# EAGLE design Smartwatch-EXTRA-TOP (EAGLE 9.6.2)
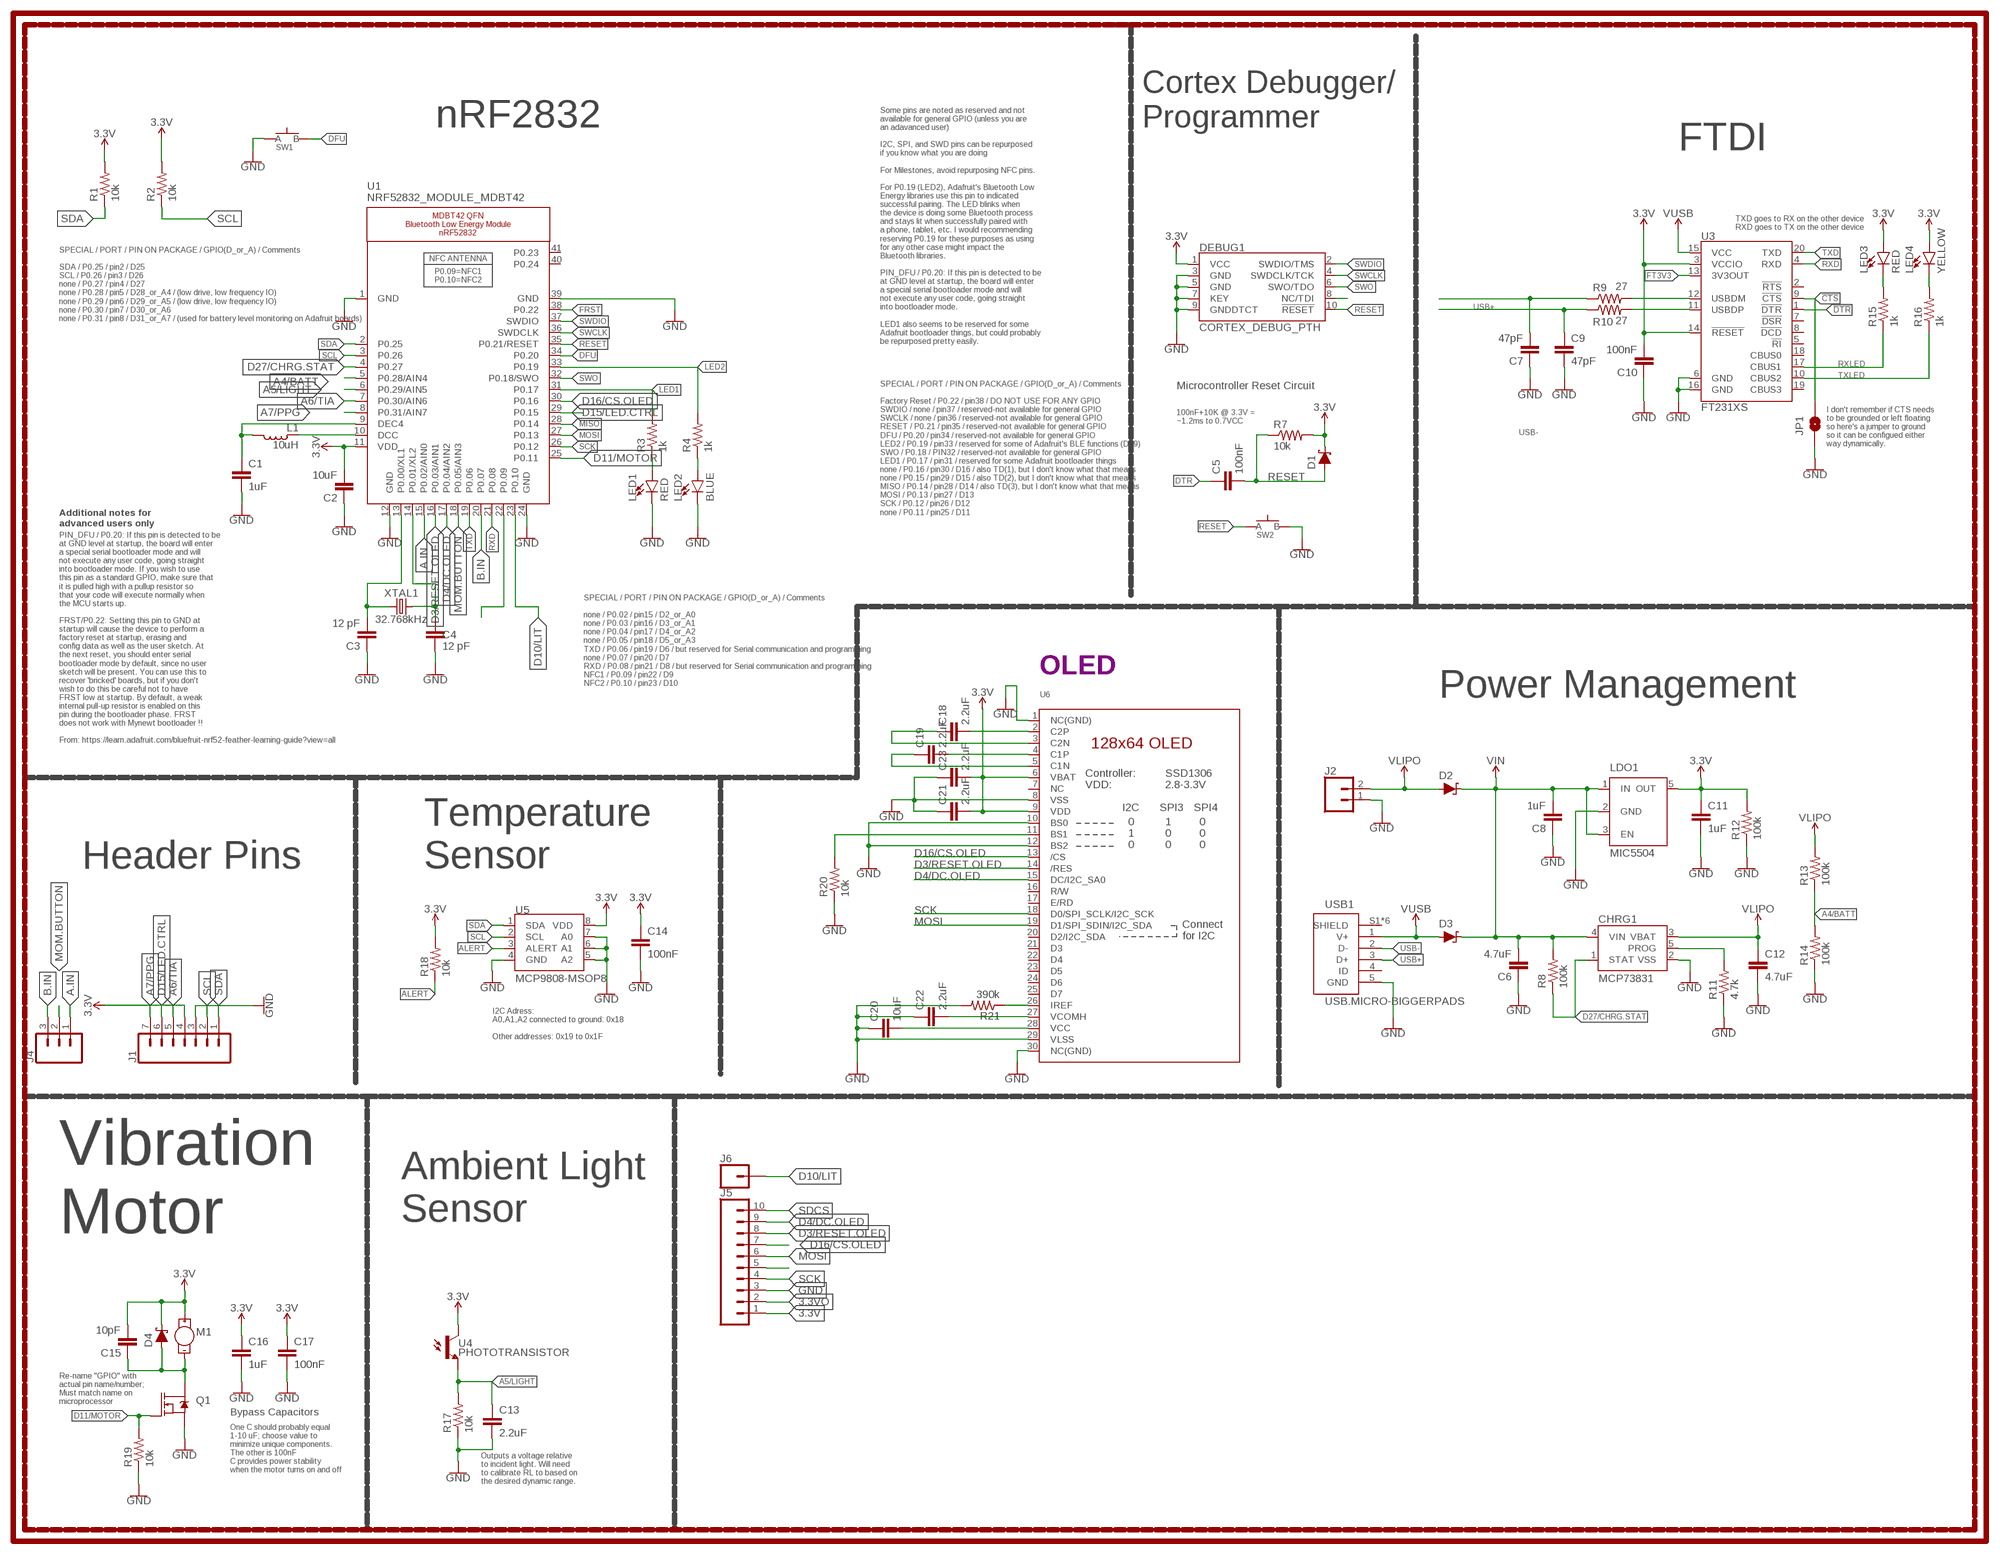
[diagram p0: schematic, sheet 1]

## Parts
C1  1uF  CAPACITOR0603  [C0603]
C2  10uF  CAPACITOR0805  [C0805]
C3  12 pF  CAPACITOR0603  [C0603]
C4  12 pF  CAPACITOR0603  [C0603]
C5  100nF  CAPACITOR0603  [C0603]
C6  4.7uF  CAPACITOR0603  [C0603]
C7  47pF  CAPACITOR0603  [C0603]
C8  1uF  CAPACITOR0603  [C0603]
C9  47pF  CAPACITOR0603  [C0603]
C10  100nF  CAPACITOR0603  [C0603]
C11  1uF  CAPACITOR0603  [C0603]
C12  4.7uF  CAPACITOR0603  [C0603]
C13  2.2uF  CAPACITOR0603  [C0603]
C14  100nF  CAPACITOR0603  [C0603]
C15  10pF  CAPACITOR0603  [C0603]
C16  1uF  CAPACITOR0603  [C0603]
C17  100nF  CAPACITOR0603  [C0603]
C18  2.2uF  CAPACITOR0402  [C0402]
C19  2.2uF  CAPACITOR0402  [C0402]
C20  10uF  CAPACITOR0603  [C0603]
C21  2.2uF  CAPACITOR0402  [C0402]
C22  2.2uF  CAPACITOR0402  [C0402]
C23  2.2uF  CAPACITOR0402  [C0402]
CHRG1  MCP73831  [SOT23-5]
D1  SCHOTTKY-USC  [USC]
D2  SCHOTTKY-USC  [USC]
D3  SCHOTTKY-USC  [USC]
D4  SCHOTTKY-USC  [USC]
DEBUG1  CORTEX_DEBUG_PTH  [2X5-PTH-1.27MM]
J1  CONN_07-1.27MM  [1X07_1.27MM]
J2  CONN_02  [1X02]
J4  CONN_03.50MIL  [1X03_1.27MM]
J5  CONN_10  [1X10_NO_SILK]
J6  CONN_01  [1X01]
JP1  JUMPER-SMT_2_NO_SILK  [SMT-JUMPER_2_NO_SILK]
L1  10uH  INDUCTOR0603  [L0603]
LDO1  MIC5504  [SOT23-5]
LED1  RED  LED0603  [LED-0603]
LED2  BLUE  LED0603  [LED-0603]
LED3  RED  LED0603  [LED-0603]
LED4  YELLOW  LED0603  [LED-0603]
M1  VIB.MOTOR.C0720B015F  [WIRE.LEADS]
Q1  NFET-AO3404A  [SOT23-3]
R1  10k  RESISTOR0603  [R0603]
R2  10k  RESISTOR0603  [R0603]
R3  1k  RESISTOR0603  [R0603]
R4  1k  RESISTOR0603  [R0603]
R7  10k  RESISTOR0603  [R0603]
R8  100k  RESISTOR0603  [R0603]
R9  27  RESISTOR0603  [R0603]
R10  27  RESISTOR0603  [R0603]
R11  4.7k  RESISTOR0603  [R0603]
R12  100k  RESISTOR0603  [R0603]
R13  100k  RESISTOR0603  [R0603]
R14  100k  RESISTOR0603  [R0603]
R15  1k  RESISTOR0603  [R0603]
R16  1k  RESISTOR0603  [R0603]
R17  10k  RESISTOR0603  [R0603]
R18  10k  RESISTOR0603  [R0603]
R19  10k  RESISTOR0603  [R0603]
R20  10k  RESISTOR0603  [R0603]
R21  390k  RESISTOR0603  [R0603]
SW1  SPST-PTS830GG140-COPY.1-3  [BUTTON-GULLWING]
SW2  SPST-PTS830GG140-COPY.1-3  [BUTTON-GULLWING]
U1  NRF52832_MODULE_MDBT42  [BLE_MODULE_RAYTAC_MDBT42]
U3  FT231XS  [SSOP20_L]
U4  PHOTOTRANSISTOR  [R0603]
U5  MCP9808-MSOP8  [MSOP08]
U6  DISP_OLED_UG-2864HSWEG01-NO-WRAPAROUND  [UG-2864HSWEG01_0.96IN_NO-WRAPAROUND]
USB1  USB.MICRO-BIGGERPADS  [USB-MICRO-01.BIGGERPADS]
XTAL1  32.768kHz  CRYSTALECS-.327-12.5-12-C-TR  [2-SMD.NOLEAD.2.0MMTO1.2MM]

## Nets
3: J5.5
3.3V: C2.2 C10.2 C11.1 C14.1 C15.2 C16.1 C17.1 C21.2 C23.2 D1.-(C) D4.-(C) DEBUG1.1(VCC) J1.4 J5.1 LDO1.5(OUT) LED3.A LED4.A M1.+ R1.2 R2.2 R7.2 R12.2 R18.2 U1.11(VDD) U3.3(VCCIO) U3.14(!RESET) U4.1(C) U5.8(VDD) U6.6(VBAT) U6.9(VDD)
3.3VO: J5.2
!CTS: JP1.2 U3.9(!CTS)
!DTR: U3.1(!DTR)
A4/BATT: R13.1 R14.2 U1.5(P0.28/AIN4)
A5/LIGHT: C13.1 R17.2 U1.6(P0.29/AIN5) U4.2(E)
A6/TIA: J1.5 U1.7(P0.30/AIN6)
A7/PPG: J1.7 U1.8(P0.31/AIN7)
A.IN: J4.1 U1.15(P0.02/AIN0)
ALERT: R18.1 U5.3(ALERT)
B.IN: J4.3 U1.20(P0.07)
D3/RESET.OLED: J5.8 U1.16(P0.03/AIN1) U6.14(/RES)
D4/DC.OLED: J5.9 U1.17(P0.04/AIN2) U6.15(DC/I2C_SA0)
D10/LIT: J6.1 U1.23(P0.10)
D11/MOTOR: Q1.1(G) R19.2 U1.25(P0.11)
D15/LED.CTRL: J1.6 U1.29(P0.15)
D16/CS.OLED: J5.7 U1.30(P0.16) U6.13(/CS)
D27/CHRG.STAT: CHRG1.1(STAT) R8.1 U1.4(P0.27)
DFU: SW1.3(B) U1.34(P0.20)
DTR: C5.1
FRST: U1.38(P0.22)
FT3V3: U3.13(3V3OUT)
GND: C1.2 C2.1 C3.1 C4.2 C6.1 C7.1 C8.1 C9.2 C10.1 C11.2 C12.2 C13.2 C14.2 C16.2 C17.2 C20.1 C21.1 C22.1 C23.1 CHRG1.2(VSS) DEBUG1.3(GND) DEBUG1.5(GND) DEBUG1.7(KEY) DEBUG1.9(GNDDTCT) J1.3 J2.1 J5.3 JP1.1 LDO1.2(GND) LED1.C LED2.C Q1.2(S) R11.1 R12.1 R14.1 R17.1 R19.1 R20.1 R21.2 SW1.1(A) SW2.3(B) U1.1(GND) U1.12(GND) U1.24(GND) U1.39(GND) U3.6(GND) U3.16(GND) U5.4(GND) U5.5(A2) U5.6(A1) U5.7(A0) U6.1(NC(GND)) U6.8(VSS) U6.10(BS0) U6.12(BS2) U6.29(VLSS) U6.30(NC(GND)) USB1.5(GND)
LED1: R3.2 U1.31(P0.17)
LED2: R4.2 U1.33(P0.19)
MISO: U1.28(P0.14)
MOM.BUTTON: J4.2 U1.18(P0.05/AIN3)
MOSI: J5.6 U1.27(P0.13) U6.19(D1/SPI_SDIN/I2C_SDA)
N$4: C3.2 U1.13(P0.00/XL1) XTAL1.P$1
N$5: R20.2 U6.11(BS1)
N$6: C4.1 U1.14(P0.01/XL2) XTAL1.P$2
N$7: R21.1 U6.26(IREF)
N$8: C18.2 U6.2(C2P)
N$9: LED1.A R3.1
N$10: LED2.A R4.1
N$11: L1.1 U1.10(DCC)
N$12: C1.1 L1.2 U1.9(DEC4)
N$13: C18.1 U6.3(C2N)
N$14: DEBUG1.8(NC/TDI)
N$15: C19.2 U6.4(C1P)
N$16: CHRG1.5(PROG) R11.2
N$17: C19.1 U6.5(C1N)
N$18: C15.1 D4.+(A) M1.- Q1.3(D)
N$19: C20.2 U6.28(VCC)
N$20: C22.2 U6.27(VCOMH)
N$25: R9.2 U3.12(USBDM)
N$26: R10.2 U3.11(USBDP)
N$27: LED3.C R15.2
N$28: LED4.C R16.2
P0.09/NFC1: U1.22(P0.09)
RESET: C5.2 D1.+(A) DEBUG1.10(!RESET) R7.1 SW2.1(A) U1.35(P0.21/RESET)
RXD: U1.21(P0.08) U3.4(RXD)
RXLED: R15.1 U3.17(CBUS1)
SCK: J5.4 U1.26(P0.12) U6.18(D0/SPI_SCLK/I2C_SCK)
SCL: J1.2 R2.1 U1.3(P0.26) U5.2(SCL)
SDA: J1.1 R1.1 U1.2(P0.25) U5.1(SDA)
SDCS: J5.10
SWCLK: DEBUG1.4(SWDCLK/TCK) U1.36(SWDCLK)
SWDIO: DEBUG1.2(SWDIO/TMS) U1.37(SWDIO)
SWO: DEBUG1.6(SWO/TDO) U1.32(P0.18/SWO)
TXD: U1.19(P0.06) U3.20(TXD)
TXLED: R16.1 U3.10(CBUS2)
USB+: C9.1 R10.1 USB1.3(D+)
USB-: C7.2 R9.1 USB1.2(D-)
V_USB: D3.+(A) U3.15(VCC) USB1.1(V+) ; supply symbol labelled VUSB
VIN: C6.2 C8.2 CHRG1.4(VIN) D2.-(C) D3.-(C) LDO1.1(IN) LDO1.3(EN) R8.2
VLIPO: C12.1 CHRG1.3(VBAT) D2.+(A) J2.2 R13.2
Unconnected: U1.40(P0.24) U1.41(P0.23) U3.2(!RTS) U3.5(!RI) U3.7(!DSR) U3.8(!DCD) U3.18(CBUS0) U3.19(CBUS3) U6.7(NC) U6.16(R/W) U6.17(E/RD) U6.20(D2/I2C_SDA) U6.21(D3) U6.22(D4) U6.23(D5) U6.24(D6) U6.25(D7) USB1.4(ID) USB1.S1(SHIELD) USB1.S2(SHIELD) USB1.S3(SHIELD) USB1.S4(SHIELD) USB1.S5(SHIELD) USB1.S6(SHIELD)

## Notes on the sheet
- nRF2832
- Cortex Debugger/
  Programmer
- FTDI
- TXD goes to RX on the other device
  RXD goes to TX on the other device
- SPECIAL / PORT / PIN ON PACKAGE / GPIO(D_or_A) / Comments
  
  SDA / P0.25 / pin2 / D25
  SCL / P0.26 / pin3 / D26
  none / P0.27 / pin4 / D27
  none / P0.28 / pin5 / D28_or_A4 / (low drive, low frequency IO)
  none / P0.29 / pin6 / D29_or_A5 / (low drive, low frequency IO)
  none / P0.30 / pin7 / D30_or_A6
  none / P0.31 / pin8 / D31_or_A7 / (used for battery level monitoring on Adafruit boards)
- Some pins are noted as reserved and not
  available for general GPIO (unless you are
  an adavanced user)
  
  I2C, SPI, and SWD pins can be repurposed
  if you know what you are doing
  
  For Milestones, avoid repurposing NFC pins.
  
  For P0.19 (LED2), Adafruit's Bluetooth Low
  Energy libraries use this pin to indicated
  successful pairing. The LED blinks when
  the device is doing some Bluetooth process
  and stays lit when successfully paired with
  a phone, tablet, etc. I would recommending
  reserving P0.19 for these purposes as using
  for any other case might impact the
  Bluetooth libraries.
  
  PIN_DFU / P0.20: If this pin is detected to be
  at GND level at startup, the board will enter
  a special serial bootloader mode and will
  not execute any user code, going straight
  into bootloader mode.
  
  LED1 also seems to be reserved for some
  Adafruit bootloader things, but could probably
  be repurposed pretty easily.
- Microcontroller Reset Circuit
- 100nF+10K @ 3.3V =
  ~1.2ms to 0.7VCC
- I don't remember if CTS needs
  to be grounded or left floating
  so here's a jumper to ground
  so it can be configued either
  way dynamically.
- SPECIAL / PORT / PIN ON PACKAGE / GPIO(D_or_A) / Comments
  
  Factory Reset / P0.22 / pin38 / DO NOT USE FOR ANY GPIO
  SWDIO / none / pin37 / reserved-not available for general GPIO
  SWCLK / none / pin36 / reserved-not available for general GPIO
  RESET / P0.21 / pin35 / reserved-not available for general GPIO
  DFU / P0.20 / pin34 / reserved-not available for general GPIO
  LED2 / P0.19 / pin33 / reserved for some of Adafruit's BLE functions (D19)
  SWO / P0.18 / PIN32 / reserved-not available for general GPIO
  LED1 / P0.17 / pin31 / reserved for some Adafruit bootloader things
  none / P0.16 / pin30 / D16 / also TD(1), but I don't know what that means
  none / P0.15 / pin29 / D15 / also TD(2), but I don't know what that means
  MISO / P0.14 / pin28 / D14 / also TD(3), but I don't know what that means
  MOSI / P0.13 / pin27 / D13
  SCK / P0.12 / pin26 / D12
  none / P0.11 / pin25 / D11
- Additional notes for
  advanced users only
- OLED
- SPECIAL / PORT / PIN ON PACKAGE / GPIO(D_or_A) / Comments
  
  none / P0.02 / pin15 / D2_or_A0
  none / P0.03 / pin16 / D3_or_A1
  none / P0.04 / pin17 / D4_or_A2
  none / P0.05 / pin18 / D5_or_A3
  TXD / P0.06 / pin19 / D6 / but reserved for Serial communication and programming
  none / P0.07 / pin20 / D7
  RXD / P0.08 / pin21 / D8 / but reserved for Serial communication and programming
  NFC1 / P0.09 / pin22 / D9
  NFC2 / P0.10 / pin23 / D10
- Power Management
- PIN_DFU / P0.20: If this pin is detected to be
  at GND level at startup, the board will enter
  a special serial bootloader mode and will
  not execute any user code, going straight
  into bootloader mode. If you wish to use
  this pin as a standard GPIO, make sure that
  it is pulled high with a pullup resistor so
  that your code will execute normally when
  the MCU starts up.
  
  FRST/P0.22: Setting this pin to GND at
  startup will cause the device to perform a
  factory reset at startup, erasing and
  config data as well as the user sketch. At
  the next reset, you should enter serial
  bootloader mode by default, since no user
  sketch will be present. You can use this to
  recover 'bricked' boards, but if you don't
  wish to do this be careful not to have
  FRST low at startup. By default, a weak
  internal pull-up resistor is enabled on this
  pin during the bootloader phase. FRST
  does not work with Mynewt bootloader !!
  
  From: https://learn.adafruit.com/bluefruit-nrf52-feather-learning-guide?view=all
- Header Pins
- Temperature
  Sensor
- I2C Adress:
  A0,A1,A2 connected to ground: 0x18
  
  Other addresses: 0x19 to 0x1F
- Ambient Light
  Sensor
- Vibration
  Motor
- Re-name "GPIO" with
  actual pin name/number;
  Must match name on
  microprocessor
- Bypass Capacitors
- One C should probably equal
  1-10 uF; choose value to
  minimize unique components.
  The other is 100nF
  C provides power stability
  when the motor turns on and off
- Outputs a voltage relative
  to incident light. Will need
  to calibrate RL to based on
  the desired dynamic range.

## Library data of the parts
C1-C23 = LinnesLab-Passives:CAPACITOR
CHRG1 = LinnesLab-Power:MCP73831: MCP73831T Li-Ion, Li-Pol Controller Miniature single cell, fully integrated Li-Ion, Li-polymer charge management controller Datasheet <http://ww1.microchip.com/downloads/en/DeviceDoc/20001984g.pdf> SparkFun Products: SparkFun ESP32 Thing <https://www.sparkfun.com/products/13907> SparkFun 9DoF Razor IMU M0 <https://www.sparkfun.com/products/14001>; PROD_ID: IC-09995
D1-D4 = LinnesLab-DiscreteSemi:SCHOTTKY: Schottky diode A Schottky diode is a semiconductor diode which has a low forward voltage drop and a very fast switching action. Example: Digi-Key Part Number: RB161MM-20CT-ND
DEBUG1 = LinnesLab-Connectors:CORTEX_DEBUG: Cortex Debug Connector - 10 pin Supports JTAG debug, Serial Wire debug, and Serial Wire Viewer. PTH and SMD connector options available. General Connector Information <http://infocenter.arm.com/help/topic/com.arm.doc.faqs/attached/13634/cortex_debug_connectors.pdf> Products: PTH Connector <http://www.digikey.com/product-detail/en/cnc-tech/3220-10-0100-00/1175-1627-ND/3883661> -via Digi-Key SparkFun PSoc <https://www.sparkfun.com/products/13229> SparkFun T <https://www.sparkfun.com/products/13810>
J1 = LinnesLab-Connectors:CONN_07: Multi connection point. Often used as Generic Header-pin footprint for 0.1 inch spaced/style header connections On any of the 0.1 inch spaced packages, you can populate with these: Break Away Headers - Straight <https://www.sparkfun.com/products/116> (PRT-00116) Break Away Male Headers - Right Angle <https://www.sparkfun.com/products/553> (PRT-00553) Female Headers <https://www.sparkfun.com/products/115> (PRT-00115) Break Away Headers - Machine Pin <https://www.sparkfun.com/products/117> (PRT-00117) Break Away Female Headers - Swiss Machine Pin <https://www.sparkfun.com/products/743> (PRT-00743) For SCREWTERMINALS and SPRING TERMINALS visit here: Screw Terimnals on SparkFun.com <https://www.sparkfun.com/search/results?term=Screw+Terminals> (5mm/3.5mm/2.54mm spacing) This device is also useful as a general connection point to wire up your design to another part of your project. Our various solder wires solder well into these plated through hole pads. Hook-Up Wire - Assortment (Stranded, 22 AWG) <https://www.sparkfun.com/products/11375> (PRT-11375) Hook-Up Wire - Assortment (Solid Core, 22 AWG) <https://www.sparkfun.com/products/11367> (PRT-11367) View the entire wire category on our website here <https://www.sparkfun.com/categories/141> Special notes: Molex polarized connector foot print use with SKU : PRT-08231 with associated crimp pins and housings. 1MM SMD Version SKU: PRT-10208 NOTES ON THE VARIANTS LOCK and LOCK_LONGPADS... This footprint was designed to help hold the alignment of a through-hole component (i.e. 6-pin header) while soldering it into place. You may notice that each hole has been shifted either up or down by 0.005 of an inch from it's more standard position (which is a perfectly straight line). This slight alteration caused the pins (the squares in the middle) to touch the edges of the holes. Because they are alternating, it causes a "brace" to hold the component in place. 0.005 has proven to be the perfect amount of "off-center" position when using our standard breakaway headers. Although looks a little odd when you look at the bare footprint, once you have a header in there, the alteration is very hard to notice. Also,if you push a header all the way into place, it is covered up entirely on the bottom side.
J2 = LinnesLab-Connectors:CONN_02: Multi connection point. Often used as Generic Header-pin footprint for 0.1 inch spaced/style header connections On any of the 0.1 inch spaced packages, you can populate with these: Break Away Headers - Straight <https://www.sparkfun.com/products/116> (PRT-00116) Break Away Male Headers - Right Angle <https://www.sparkfun.com/products/553> (PRT-00553) Female Headers <https://www.sparkfun.com/products/115> (PRT-00115) Break Away Headers - Machine Pin <https://www.sparkfun.com/products/117> (PRT-00117) Break Away Female Headers - Swiss Machine Pin <https://www.sparkfun.com/products/743> (PRT-00743) For SCREWTERMINALS and SPRING TERMINALS visit here: Screw Terimnals on SparkFun.com <https://www.sparkfun.com/search/results?term=Screw+Terminals> (5mm/3.5mm/2.54mm spacing) This device is also useful as a general connection point to wire up your design to another part of your project. Our various solder wires solder well into these plated through hole pads. Hook-Up Wire - Assortment (Stranded, 22 AWG) <https://www.sparkfun.com/products/11375> (PRT-11375) Hook-Up Wire - Assortment (Solid Core, 22 AWG) <https://www.sparkfun.com/products/11367> (PRT-11367) View the entire wire category on our website here <https://www.sparkfun.com/categories/141> Special notes: Molex polarized connector foot print use with: PRT-08233 with associated crimp pins and housings. 2.54_SCREWTERM for use with PRT-10571. 3.5mm Screw Terminal footprints for PRT-08084 5mm Screw Terminal footprints for use with PRT-08432
J4 = LinnesLab-Connectors:CONN_03: Multi connection point. Often used as Generic Header-pin footprint for 0.1 inch spaced/style header connections On any of the 0.1 inch spaced packages, you can populate with these: Break Away Headers - Straight <https://www.sparkfun.com/products/116> (PRT-00116) Break Away Male Headers - Right Angle <https://www.sparkfun.com/products/553> (PRT-00553) Female Headers <https://www.sparkfun.com/products/115> (PRT-00115) Break Away Headers - Machine Pin <https://www.sparkfun.com/products/117> (PRT-00117) Break Away Female Headers - Swiss Machine Pin <https://www.sparkfun.com/products/743> (PRT-00743) Stackable Header - 3 Pin (Female, 0.1") <https://www.sparkfun.com/products/13875> (PRT-13875) For SCREWTERMINALS and SPRING TERMINALS visit here: Screw Terimnals on SparkFun.com <https://www.sparkfun.com/search/results?term=Screw+Terminals> (5mm/3.5mm/2.54mm spacing) This device is also useful as a general connection point to wire up your design to another part of your project. Our various solder wires solder well into these plated through hole pads. Hook-Up Wire - Assortment (Stranded, 22 AWG) <https://www.sparkfun.com/products/11375> (PRT-11375) Hook-Up Wire - Assortment (Solid Core, 22 AWG) <https://www.sparkfun.com/products/11367> (PRT-11367) View the entire wire category on our website here <https://www.sparkfun.com/categories/141> Special notes: Molex polarized connector foot print use with SKU : PRT-08232 with associated crimp pins and housings.
J5 = LinnesLab-Connectors:CONN_10
J6 = LinnesLab-Connectors:CONN_01: Single connection point. Often used as Generic Header-pin footprint for 0.1 inch spaced/style header connections On any of the 0.1 inch spaced packages, you can populate with these: Break Away Headers - Straight <https://www.sparkfun.com/products/116> (PRT-00116) Break Away Male Headers - Right Angle <https://www.sparkfun.com/products/553> (PRT-00553) Female Headers <https://www.sparkfun.com/products/115> (PRT-00115) Break Away Headers - Machine Pin <https://www.sparkfun.com/products/117> (PRT-00117) Break Away Female Headers - Swiss Machine Pin <https://www.sparkfun.com/products/743> (PRT-00743) This device is also useful as a general connection point to wire up your design to another part of your project. Our various solder wires solder well into these plated through hole pads. Hook-Up Wire - Assortment (Stranded, 22 AWG) <https://www.sparkfun.com/products/11375> (PRT-11375) Hook-Up Wire - Assortment (Solid Core, 22 AWG) <https://www.sparkfun.com/products/11367> (PRT-11367) View the entire wire category on our website here <https://www.sparkfun.com/categories/141> Special notes: SMTSO-256-ET is a "flush mount" nut for a 4-40 screw. We mostly use this on specialty testbeds; it is a nice way to connect hardware to your PCB at an adjustable hieght. Also note, the SNAP packages are for using a snappable style connector. We sell a baggie of snaps and they are also used on two LilyPad designs: Snap Assortment - 30 pack (male and female) <https://www.sparkfun.com/products/11347> (DEV-11347) LilyPad Arduino SimpleSnap <https://www.sparkfun.com/products/10941> (DEV-10941) LilyPad SimpleSnap Protoboard <https://www.sparkfun.com/products/10940> (DEV-10940)
JP1 = LinnesLab-Switches:JUMPER-SMT_2_NO: Normally open jumper This jumper has two pads in close proximity to each other. Apply solder to close the connection. Round pads are easier to solder for beginners, but are a lot larger. SparkFun Product that uses the round pads: SparkFun EL Sequencer <https://www.sparkfun.com/products/12781>
L1 = LinnesLab-Passives:INDUCTOR
LDO1 = LinnesLab-Power:MIC5504: MIC5504 Voltage Regulator Output Voltages: 1.0V to 3.3V Input Voltages: 2.5V to 5.5V Link to Datasheet http://ww1.microchip.com/downloads/en/DeviceDoc/MIC550X.pdf
LED1-LED4 = LinnesLab-LED:LED: LED (Generic) Standard schematic elements and footprints for 5mm, 3mm, 1206, and 0603 sized LEDs. Generic LEDs with no color specified. LTST-C190KGKT: arrow indicates cathode
M1 = LinnesLab-Electromechanical:VIB.MOTOR.C0720B015F
Q1 = LinnesLab-DiscreteSemi:NFET: N-channel MOSFETs Voltage controlled devices that allow control of high current outputs. SparkFun Products: SparkFun OpenScale <https://www.sparkfun.com/products/13261> SparkFun Digital Sandbox <https://www.sparkfun.com/products/12651> SparkFun Monster Moto Shield <https://www.sparkfun.com/products/10182> SparkFun MOSFET Power Controller <https://www.sparkfun.com/products/11214>
R1-R4 R7-R21 = LinnesLab-Passives:RESISTOR
SW1 SW2 = LinnesLab-Switches:SPST-PTS830GG140-COPY
U1 = LinnesLab-Microcontrollers:NRF52832_MODULE_MDBT42: MDBT42 - BLE Module (nRF52832 QFN) VDD: 1.7-3.6V; SPICEPREFIX: X
U3 = LinnesLab-DigitalIC:FT231X: FTDI FT231X Full Speed USB to Full-handshake UART This USB2.0 Full Speed IC offers a compact bridge to full handshake UART interfaces. The device is a UART, capable of operating up to 3MBaud, with low power consumption (8mA). The FT231X includes the complete FT-X series feature set and enables USB to be added into a system design quickly and easily over a UART interface. Datasheet <http://cdn.sparkfun.com/datasheets/Components/General%20IC/DS_FT231X.pdf>; DIGIKEY: 768-1156-5-ND; MFN: FT231XS-U
U4 = LinnesLab-Sensors:PHOTOTRANSISTOR
U5 = LinnesLab-Sensors:MCP9808; SPICEPREFIX: X
U6 = LinnesLab-Displays:DISP_OLED_UG-2864HSWEG01: UG-2864HSWEG01 OLED display Both 1.3" and 0.96" models share the same FPC tab footprint, only the screen dimensions vary.
USB1 = LinnesLab-Connectors:USB.MICRO: DigiKey PN: 609-4613-1-ND
XTAL1 = LinnesLab-Clocks:CRYSTAL; DIGIKEY: XC2288CT-ND; FREQ: 32.7680KHZ; LOAD_CAP: 12.5pF

## Board
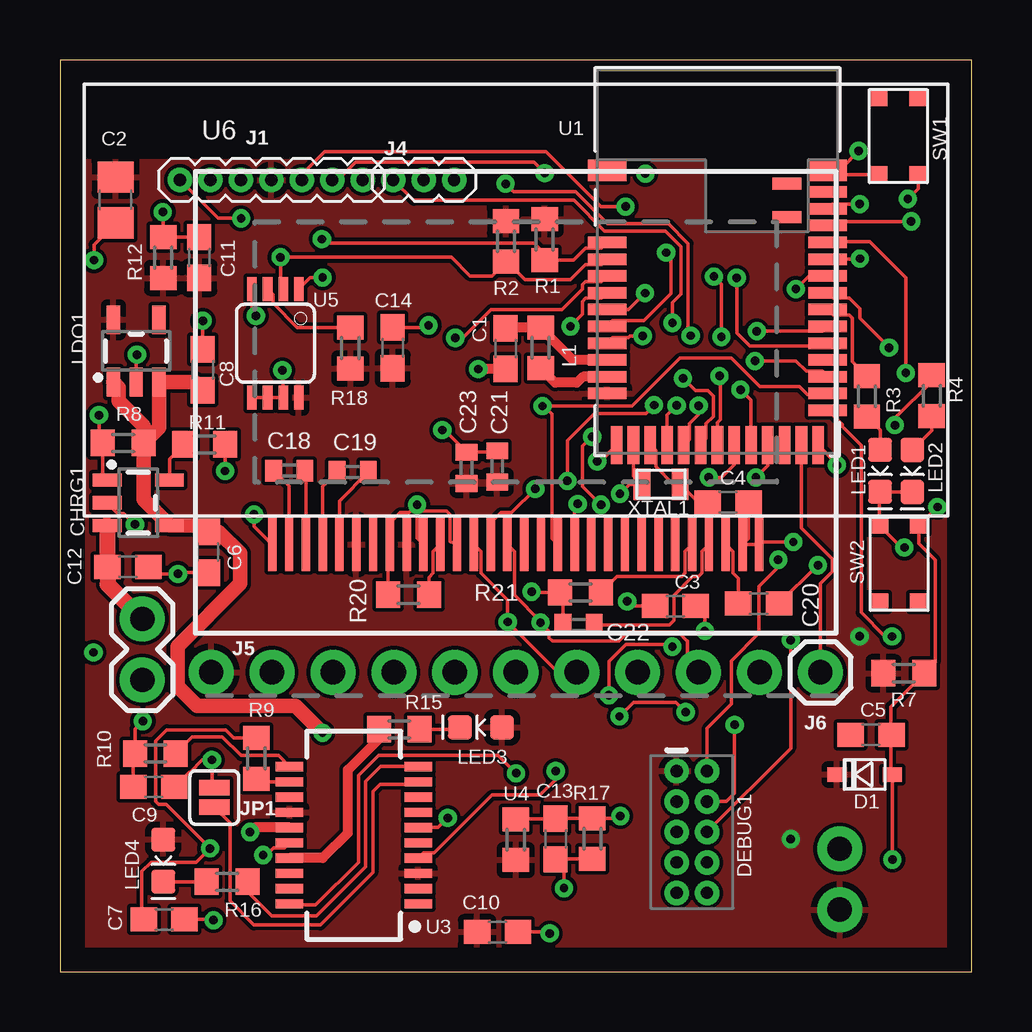
[diagram p1: board, top side]
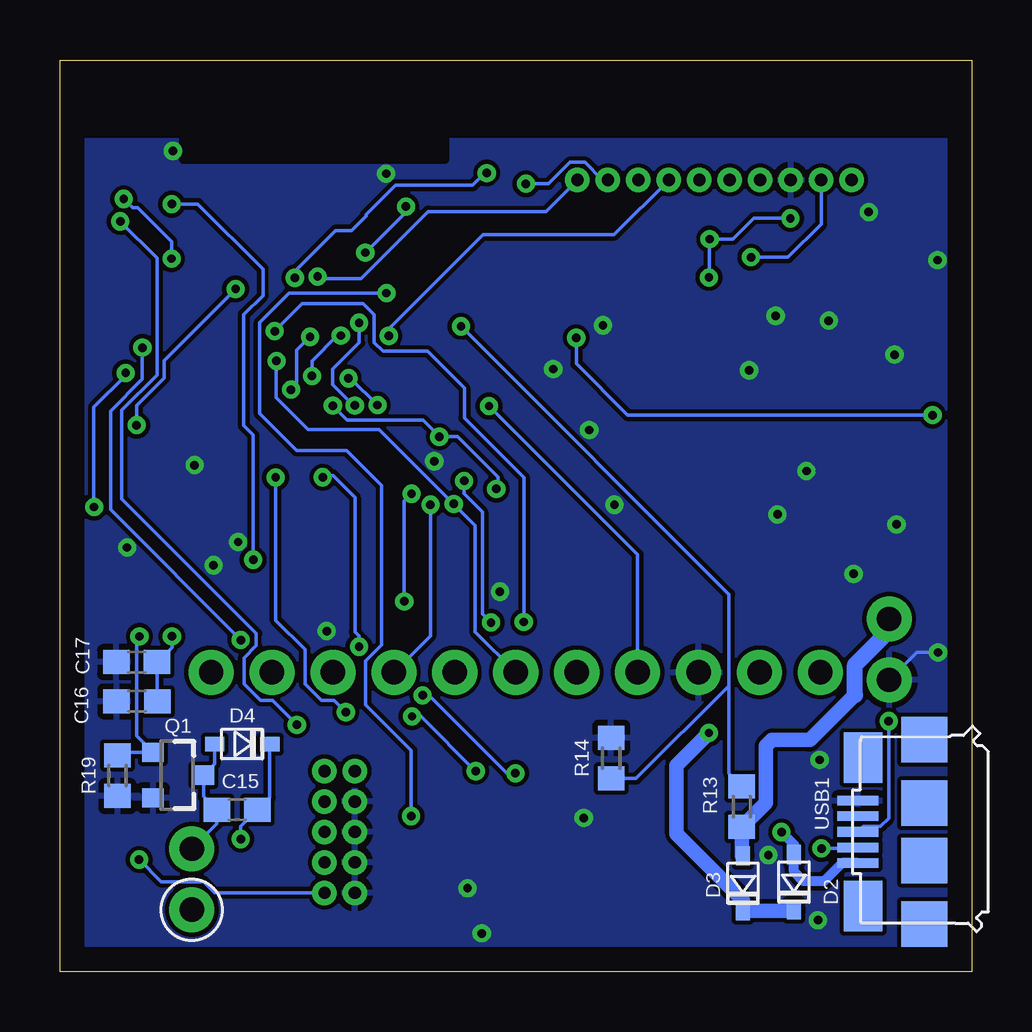
[diagram p2: board, bottom side, seen from below]

Size 38 x 38 mm. Coordinates in mm from the lower left corner, seen from the top.
Outline: 0,0 38,0 38,38 0,38 0,0
Copper layers (1*16): Top 0.035mm / dielectric 1.5mm / Bottom 0.035mm
Design rules "default": minimum track width 6mil, minimum drill 0.35mm, track to track 6mil, track to pad 6mil, pad to pad 6mil, via to via 6mil, smd to smd 6mil, copper to edge 40mil, drill to drill 6mil, minimum pad ring 10mil, minimum via ring 8mil, stop-mask expansion 4mil, vias tented up to drill 0mil, thermal gap 10mil

### Footprints (pad centres in the part's own frame; a part is rotated, then mirrored left to right if it is on the bottom)
C0603 = smd 1.1 x 1: 1 -0.85,0; 2 0.85,0
C0805 = smd 1.3 x 1.5: 1 -0.95,0; 2 0.95,0
C0402 = smd 0.7 x 0.9: 1 -0.65,0; 2 0.65,0
SOT23-5 = smd 0.55 x 1.2: 1 -0.95,-1.3; 2 0,-1.3; 3 0.95,-1.3; 4 0.95,1.3; 5 -0.95,1.3
USC = smd 0.8 x 0.6: + -1.15,0; - 1.15,0
2X5-PTH-1.27MM = drill 0.508 pad 1: 1 -2.54,-0.635; 2 -2.54,0.635; 3 -1.27,-0.635; 4 -1.27,0.635; 5 0,-0.635; 6 0,0.635; 7 1.27,-0.635; 8 1.27,0.635; 9 2.54,-0.635; 10 2.54,0.635
1X07_1.27MM = drill 0.508 pad 1: 1 0,0; 2 1.27,0; 3 2.54,0; 4 3.81,0; 5 5.08,0; 6 6.35,0; 7 7.62,0
1X02 = drill 1.016 pad 1.88: 1 0,0; 2 2.54,0
1X03_1.27MM = drill 0.508 pad 1: 1 0,0; 2 1.27,0; 3 2.54,0
1X10_NO_SILK = drill 1.016 pad 1.88: 1 0,0; 2 2.54,0; 3 5.08,0; 4 7.62,0; 5 10.16,0; 6 12.7,0; 7 15.24,0; 8 17.78,0; 9 20.32,0; 10 22.86,0
1X01 = drill 1.016 pad 1.88: 1 0,0
SMT-JUMPER_2_NO_SILK = smd 0.635 x 1.27: 1 -0.406,0; 2 0.406,0
L0603 = smd 1 x 1.1: 1 -0.85,0; 2 0.85,0
LED-0603 = smd 1 x 1: A -0.877,0; C 0.877,0
WIRE.LEADS = drill 1.016 pad 1.88: + -1.27,0; - 1.27,0
SOT23-3 = smd 0.8 x 0.9: 1 -0.95,-1; 2 0.95,-1; 3 0,1.1
R0603 = smd 1 x 1.1: 1 -0.85,0; 2 0.85,0
BUTTON-GULLWING = smd 0.7 x 0.75: 1 -1.6,0.825; 2 1.6,0.825; 3 -1.6,-0.825; 4 1.6,-0.825
BLE_MODULE_RAYTAC_MDBT42 = smd 1.6 x 0.9: 1 -4.6,3.8; 39 4.6,3.8 | smd 1.6 x 0.48: 2 -4.6,0.8; 3 -4.6,0.1; 4 -4.6,-0.6; 5 -4.6,-1.3; 6 -4.6,-2; 7 -4.6,-2.7; 8 -4.6,-3.4; 9 -4.6,-4.1; 10 -4.6,-4.8; 11 -4.6,-5.5; 25 4.6,-6.2; 26 4.6,-5.5; 27 4.6,-4.8; 28 4.6,-4.1; 29 4.6,-3.4; 30 4.6,-2.7; 31 4.6,-2; 32 4.6,-1.3; 33 4.6,-0.6; 34 4.6,0.1; 35 4.6,0.8; 36 4.6,1.5; 37 4.6,2.2; 38 4.6,2.9 | smd 0.48 x 1.6: 12 -4.2,-7.65; 13 -3.5,-7.65; 14 -2.8,-7.65; 15 -2.1,-7.65; 16 -1.4,-7.65; 17 -0.7,-7.65; 18 0,-7.65; 19 0.7,-7.65; 20 1.4,-7.65; 21 2.1,-7.65; 22 2.8,-7.65; 23 3.5,-7.65; 24 4.2,-7.65 | smd 1.2 x 0.5: 40 2.9,3.25; 41 2.9,1.85
SSOP20_L = smd 0.381 x 1.143: 1 -2.857,-2.68; 2 -2.223,-2.68; 3 -1.587,-2.68; 4 -0.953,-2.68; 5 -0.318,-2.68; 6 0.318,-2.68; 7 0.953,-2.68; 8 1.587,-2.68; 9 2.223,-2.68; 10 2.857,-2.68; 11 2.857,2.68; 12 2.223,2.68; 13 1.587,2.68; 14 0.953,2.68; 15 0.318,2.68; 16 -0.318,2.68; 17 -0.953,2.68; 18 -1.587,2.68; 19 -2.223,2.68; 20 -2.857,2.68
MSOP08 = smd 0.4 x 1: 1 -0.976,-2.263; 2 -0.326,-2.263; 3 0.324,-2.263; 4 0.974,-2.263; 5 0.974,2.262; 6 0.324,2.262; 7 -0.326,2.262; 8 -0.976,2.262
UG-2864HSWEG01_0.96IN_NO-WRAPAROUND = smd 0.35 x 2.2: 1 -10.15,-1.2; 2 -9.45,-1.2; 3 -8.75,-1.2; 4 -8.05,-1.2; 5 -7.35,-1.2; 6 -6.65,-1.2; 7 -5.95,-1.2; 8 -5.25,-1.2; 9 -4.55,-1.2; 10 -3.85,-1.2; 11 -3.15,-1.2; 12 -2.45,-1.2; 13 -1.75,-1.2; 14 -1.05,-1.2; 15 -0.35,-1.2; 16 0.35,-1.2; 17 1.05,-1.2; 18 1.75,-1.2; 19 2.45,-1.2; 20 3.15,-1.2; 21 3.85,-1.2; 22 4.55,-1.2; 23 5.25,-1.2; 24 5.95,-1.2; 25 6.65,-1.2; 26 7.35,-1.2; 27 8.05,-1.2; 28 8.75,-1.2; 29 9.45,-1.2; 30 10.15,-1.2
USB-MICRO-01.BIGGERPADS = smd 0.4 x 1.7: 1 -1.3,1.505; 2 -0.65,1.505; 3 0,1.505; 4 0.65,1.505; 5 1.3,1.505 | smd 1.9 x 1.9: S1 -3.85,-1.27; S2 -1.2,-1.27; S3 1.2,-1.27; S4 3.85,-1.27 | smd 2.1 x 1.6: S5 -3.1,1.28; S6 3.1,1.28
2-SMD.NOLEAD.2.0MMTO1.2MM = smd 0.7 x 1.3: P$1 -0.8,0; P$2 0.8,0

### Placement (x,y rotation side)
C1  18.57,25.97 270 top
C2  2.32,32.16 90 top
C3  25.65,15.23 180 top
C4  27.85,19.56 0 top
C5  33.81,9.87 0 top
C6  6.17,17.48 90 top
C7  4.34,2.17 180 top
C8  5.95,25.09 270 top
C9  3.91,7.69 0 top
C10  18.24,1.65 180 top
C11  5.81,29.77 90 top
C12  2.83,16.86 0 top
C13  20.66,5.53 270 top
C14  13.87,26 90 top
C15  30.61,6.74 0 bottom
C16  34.79,11.27 180 bottom
C17  34.8,12.9 180 bottom
C18  9.56,20.88 180 top
C19  12.2,20.83 180 top
C20  29.13,15.34 180 top
C21  18.22,21.06 270 top
C22  21.62,14.45 0 top
C23  16.95,21 270 top
CHRG1  3.26,19.55 270 top
D1  33.54,8.21 180 top
D2  9.53,3.68 270 bottom
D3  7.4,3.73 270 bottom
D4  30.4,9.48 0 bottom
DEBUG1  26.34,5.82 270 top
J1  5,33 0 top
J2  3.43,12.16 90 top
J4  13.89,33 0 top
J5  6.3,12.47 0 top
J6  31.7,12.47 0 top
JP1  6.43,7.26 270 top
L1  20.04,26 90 top
LDO1  3.17,25.87 0 top
LED1  34.19,20.88 270 top
LED2  35.53,20.87 270 top
LED3  17.55,10.18 180 top
LED4  4.31,4.63 270 top
M1  32.5,3.85 90 bottom
Q1  33.12,8.19 270 bottom
R1  20.2,30.51 90 top
R2  18.59,30.44 90 top
R3  33.63,23.98 90 top
R4  36.34,24.01 90 top
R7  35.18,12.44 180 top
R8  2.64,22.04 0 top
R9  8.19,8.88 270 top
R10  3.98,9.09 0 top
R11  6.03,21.97 180 top
R12  4.31,29.76 270 top
R13  9.58,6.88 270 bottom
R14  15.02,8.89 270 bottom
R15  14.15,10.1 0 top
R16  6.97,3.74 180 top
R17  22.2,5.54 90 top
R18  12.11,25.99 270 top
R19  35.6,8.17 90 bottom
R20  14.53,15.71 0 top
R21  21.7,15.8 180 top
SW1  34.95,34.83 90 top
SW2  34.98,17 270 top
U1  27.41,29.6 0 top
U3  12.25,5.68 90 top
U4  19,5.5 90 top
U5  8.98,26.19 180 top
U6  19,19 0 top
USB1  3.24,5.82 90 bottom
XTAL1  25.05,20.31 0 top

### Tracks (layer width: path | path; a pad name or v marks a point on that pad's centre or on a via)
3.3V  (via drill 0.35)
  Bottom 0.152: D4.- 29.25,7.25 C15.2 30.46,6.04 v30.46,5.52 | C16.1 33.95,11.28 C17.1 33.33,13.52 v33.33,13.97
  pour Top: 1,33.8 37.42,33.8 37.42,1 1,1
!CTS
  Top 0.152: U3.9 14.82,7.8 13.34,7.8 13.05,7.51 13.05,4.13 10.86,1.94 8.08,1.94 7.08,2.94 7.08,6.2 JP1.2
A4/BATT  (via drill 0.35)
  Top 0.152: U1.5 22.57,28.07 21.91,28.07 21.78,27.93 21.78,27.4 v21.28,26.9
  Bottom 0.152: R14.2 13.98,8.04 10.11,11.91 | 10.11,11.91 10.11,8.26 R13.1 | v21.28,26.9 10.11,15.73 10.11,11.91
A5/LIGHT  (via drill 0.35)
  Top 0.152: v24.39,28.28 23.7,27.6 U1.6 | U4.2 19.02,6.37 C13.1 22.18,6.38 R17.2 23.27,6.39 v23.36,6.48
  Bottom 0.152: v24.39,28.28 28.45,28.28 29.67,27.06 29.67,23.25 28.14,21.73 26.05,21.73 24.59,20.27 24.59,13.62 25.27,12.94 25.27,11.12 23.36,9.22 v23.36,6.49 v23.36,6.48
A6/TIA  (via drill 0.35)
  Top 0.152: U1.7 23.04,27.13 24.34,27.13 25.48,28.26 25.48,29.76 v25.27,29.97 | J1.5 10.08,33.23 11.02,34.17 20.27,34.17 22.55,31.89 v23.58,31.89
  Bottom 0.152: v23.58,31.89 23.58,31.66 v25.27,29.97
A7/PPG  (via drill 0.35)
  Top 0.152: U1.8 23.04,26.43 23.7,26.43 23.77,26.5 v24.29,26.5
  Bottom 0.152: v24.29,26.5 24.29,26.78 20.36,30.71 14.91,30.71 J1.7
A.IN  (via drill 0.35)
  Top 0.152: U1.15 25.31,23.2 v25.71,23.6 | v25.53,27.04 25.53,27.88 25.88,28.23 25.88,30.22 25.23,30.87 22.7,30.87 21.42,32.15 14.74,32.15 J4.1
  Bottom 0.152: v25.71,23.6 25.75,23.6 26.64,24.48 26.64,25.1 25.53,26.21 v25.53,27.04
ALERT
  Top 0.152: U5.3 8.88,28.23 8.88,27.86 9.89,26.84 R18.1
B.IN  (via drill 0.35)
  Top 0.152: v27.26,28.97 27.57,28.66 v27.57,26.46 | v28.37,24.26 28.81,23.82 U1.20
  Bottom 0.152: J4.3 17.75,31.68 22.65,31.68 25.44,28.89 27.18,28.89 v27.26,28.97 | v27.57,26.46 28.12,25.91 28.12,24.5 v28.37,24.26
D3/RESET.OLED  (via drill 0.35)
  Top 0.152: U1.16 26.24,22.18 26.24,22.84 26.63,23.23 v26.63,23.59 | v22.55,19.46 21.79,20.22 21.79,21.9 v22.19,22.29 | v19.82,20.12 18.83,19.13 18.38,19.13 17.95,18.7 U6.14
  Bottom 0.152: v26.63,23.59 26.03,22.99 22.87,22.99 22.19,22.3 v22.19,22.29 21.43,22.29 19.75,20.61 19.75,20.18 v19.82,20.12 | v22.55,19.46 22.55,14 J5.8
D4/DC.OLED  (via drill 0.35)
  Top 0.152: U1.17 26.69,21.96 26.94,22.21 26.94,22.84 27.23,23.14 27.23,24 27.02,24.22 26.49,24.22 v25.98,24.73 | v24.77,23.62 24.42,23.27 22.28,23.27 21.15,22.14 v21.15,20.45 | J5.9 26.15,12.94 26.15,13.79 26.14,13.79 25.78,14.15 23.67,14.15 23.3,13.77 20.53,13.77 20.4,13.91 20.4,14.19 v20.03,14.55 20.03,14.6 18.95,15.69 18.95,17.5 U6.15
  Bottom 0.152: v24.77,23.62 25.88,24.73 v25.98,24.73 | v21.15,20.45 21.15,19.92 20.39,19.16 20.39,14.9 v20.03,14.55
D10/LIT
  Top 0.152: J6.1 31.7,16.18 32.2,16.68 32.2,17.19 30.91,18.49 U1.23
D11/MOTOR  (via drill 0.35)
  Top 0.152: U1.25 32.61,22.79 32.61,22.71 33.4,21.93 33.4,14.96 34.39,13.97 v34.69,13.97
  Bottom 0.152: R19.2 35.48,9.14 Q1.1 34.8,9.82 34.8,13.65 34.69,13.76 v34.69,13.97
D15/LED.CTRL  (via drill 0.35)
  Top 0.152: J1.6 11.58,33 12.31,33.74 19.76,33.74 v20.21,33.29 | U1.29 31.87,26.06 28.76,26.06 28.21,26.62 v28.21,28.92
  Bottom 0.152: v20.21,33.29 20.28,33.29 20.8,32.77 24.01,32.77 25.24,31.54 25.24,31.49 25.84,30.89 26.5,30.89 28.21,29.18 v28.21,28.92
D16/CS.OLED  (via drill 0.35)
  Top 0.152: U1.30 31.8,26.69 v29.05,26.69 | J5.7 20.76,12.47 v18.66,14.57 18.66,15.49 17.55,16.61 17.55,17.5 U6.13
  Bottom 0.152: v29.05,26.69 27.9,27.84 25.36,27.84 24.9,27.38 24.9,26.75 24.9,26.21 24.54,25.86 22.68,25.86 21.14,24.31 21.14,23.07 18.66,20.6 v18.66,14.57
D27/CHRG.STAT  (via drill 0.35)
  Top 0.152: CHRG1.1 1.79,20.67 R8.1 1.63,22.2 v1.63,23.2 | U1.4 22.57,28.77 21.91,28.77 21.78,28.63 21.78,28.46 20.92,27.6 17.98,27.6 16.8,26.42 v16.48,26.42
  Bottom 0.152: v1.63,23.2 14.34,23.2 16.48,25.33 v16.48,26.42
DFU  (via drill 0.35)
  Top 0.152: U1.34 33.33,29.7 v33.35,29.72 | v35.34,32.21 35.77,32.64 SW1.3
  Bottom 0.152: v35.34,32.21 34.97,31.84 34.77,31.84 33.35,30.42 v33.35,29.72
GND  (via drill 0.35)
  Top 0.152: C2.1 1.42,30.31 v1.42,29.65 | U1.1 22.83,33.37 24.29,33.37 v24.4,33.26 | SW1.1 32.17,33.23 U1.39 32.51,33.4 32.93,33.81 32.93,33.85 v33.29,34.21 | CHRG1.2 2.41,19.1 2.66,19.1 3.12,18.64 v3.13,18.64 | LDO1.2 3.17,25.68 v3.21,25.71 | C12.2 3.97,16.58 v4.92,16.58 4.97,16.63 C6.1 | U1.24 32.39,21.16 v32.39,21.11 | R11.1 v6.88,20.87 | C8.1 v5.95,27.13 | v5.95,27.13 | C11.2 R12.1 4.3,31.64 v4.29,31.66 | C9.2 5.38,8.31 5.42,8.31 5.94,8.82 v6.33,8.82 6.33,7.76 JP1.1 | LED2.C LED1.C | LED1.C | R17.1 20.68,4.69 C13.2 21.01,4.33 v21.01,3.47 | U3.6 15.77,6 v16.17,6.4 | U5.5 U5.6 U5.7 9.3,25.03 v9.27,25.07 | U5.4 8.01,27.49 v8.16,27.33 | C14.2 15.28,26.85 v15.37,26.94 | C7.1 6.37,2.17 v6.4,2.14 | U1.12 22.53,21.27 v22.4,21.27 | C10.1 20.36,1.65 v20.41,1.59 | U3.16 9.36,5.15 8.9,5.15 8.61,4.85 v8.47,4.85 | LED1.C 34.16,19.95 SW2.3 35.08,17.68 v35.2,17.68 | R20.1 13.68,17.57 U6.8 13.75,18.7 14.18,19.13 14.56,19.13 v14.89,19.46 | U6.12 16.26,17.93 16.26,19.05 16.12,19.19 15.15,19.19 v14.89,19.46 | v14.89,19.46 14.89,18.06 U6.10 15.15,16.9 | U6.1 8.09,18.56 v8.09,19.06 | C3.1 26.88,14.86 v26.88,14.19 | v19.66,15.83 19.69,15.8 R21.2 20.97,15.68 C22.1 | C21.1 18.16,21.65 C23.1 16.02,22.57 v15.94,22.57 | C20.1 31.57,16.94 v31.6,16.94 | C4.2 28.7,18.05 U6.29 U6.30 29.25,17.9 v30.57,17.9
  Top 0.406: C1.2 v17.44,25.12 v17.43,25.11
  Bottom 0.152: v33.29,34.21 33.29,34.18 | v1.39,13.3 2.29,13.3 J2.1
  pour Bottom (isolate 0.178): 0.99,34.68 0.99,0.99 37.41,0.99 37.41,34.68
LED1
  Top 0.152: R3.2 33.03,25.43 33.03,27.23 32.9,27.37 32.24,27.37 U1.31
LED2  (via drill 0.35)
  Top 0.152: R4.2 36.34,24.6 34.81,23.07 v34.81,22.78 | v30.68,28.45 31.22,29 U1.33
  Bottom 0.152: v30.68,28.45 33.65,25.48 33.65,24.74 34.81,23.59 v34.81,22.78
MOM.BUTTON  (via drill 0.35)
  Top 0.152: U1.18 27.41,22.88 27.54,23.01 27.54,24.78 v27.49,24.83 | v26.29,26.51 26.18,26.62 26.18,30.35 25.36,31.17 22.83,31.17 21.5,32.5 18.91,32.5 v18.57,32.84
  Bottom 0.152: v27.49,24.83 27.49,25.46 26.44,26.51 v26.29,26.51 | v18.57,32.84 17.64,32.84 16.73,33.74 16.12,33.74 15.39,33 J4.2
MOSI  (via drill 0.35)
  Top 0.152: v28.97,25.45 30.68,25.45 31.11,25.03 31.77,25.03 U1.27 | U6.19 21.45,19.36 v21.59,19.49
  Bottom 0.152: v28.97,25.45 28.99,25.44 28.99,23.94 27.65,22.6 24.69,22.6 v21.59,19.49 20.69,18.6 20.69,14.17 J5.6
N$4  (via drill 0.35)
  Top 0.152: U1.13 23.91,20.66 XTAL1.P$1 23.74,20.31 v23.34,19.92 | C3.2 23.85,15.23 v23.65,15.43
  Bottom 0.152: v23.34,19.92 23.65,19.62 v23.65,15.43
N$5
  Top 0.152: U6.11 15.55,17.5 15.55,16.61 15.38,16.43 R20.2
N$6
  Top 0.152: U1.14 24.84,21.72 24.84,21.04 25.57,20.31 XTAL1.P$2 26.61,19.56 C4.1
N$7
  Top 0.152: R21.1 23.22,16.47 25.92,16.47 26.05,16.61 26.05,17.5 U6.26
N$8
  Top 0.152: U6.2 9.55,20.24 C18.2
N$9
  Top 0.152: R3.1 34.19,22.58 LED1.A
N$10
  Top 0.152: R4.1 36.34,22.56 LED2.A
N$11
  Top 0.406: U1.10 21.81,24.8 21.55,24.54 20.64,24.54 L1.1
N$12
  Top 0.406: U1.9 21.39,25.5 L1.2 18.6,26.85 C1.1
N$13
  Top 0.152: C18.1 10.25,20.84 U6.3
N$15
  Top 0.152: U6.4 10.95,20.22 C19.2
N$16
  Top 0.152: CHRG1.5 4.56,21.36 R11.2
N$17
  Top 0.152: U6.5 11.65,19.62 C19.1
N$18
  Bottom 0.152: D4.+ 31.55,8.65 Q1.3 32.02,7.29 C15.1 31.46,6.16 M1.-
N$19
  Top 0.152: U6.28 28.05,17.5 28.05,16.61 28.27,16.38 C20.2
N$20
  Top 0.152: U6.27 26.75,17.5 26.75,16.61 26.62,16.47 26.37,16.47 25.58,15.68 25.58,14.64 25.4,14.45 C22.2
N$25
  Top 0.152: U3.12 8.32,7.91 R9.2
N$26
  Top 0.152: R10.2 5.52,9.78 6.77,9.78 7.54,9.01 9.11,9.01 U3.11
N$27
  Top 0.152: LED3.C 16.59,10.1 R15.2
N$28
  Top 0.152: R16.2 LED4.C
RESET  (via drill 0.35)
  Top 0.152: v36.58,19.36 v36.57,19.36 SW2.1 35.81,17.84 36.49,17.16 36.49,12.9 R7.1 34.63,11.04 34.63,9.84 | C5.2 34.63,9.84 | 34.63,9.84 34.63,8.28 D1.+ v34.69,4.68 v34.7,4.67 | U1.35 32.03,30.42 33.76,30.42 35.26,28.92 v35.26,24.95
  Bottom 0.152: v35.26,24.95 35.26,24.85 36.58,23.52 v36.58,19.37 v36.58,19.36 | DEBUG1.10 31.55,3.28 32.02,3.74 33.78,3.74 v34.7,4.67
RXD  (via drill 0.35)
  Top 0.152: U1.21 29.51,21.09 v29.01,20.6 | U3.4 15.15,4.95 15.6,4.95 18.01,7.36 20.02,7.36 20.67,8.01 v20.67,8.35 | v26.09,10.82 25.68,11.22 23.9,11.22 23.9,11.21 v23.32,10.63
  Bottom 0.152: v29.01,20.6 29.01,14.64 27.79,13.42 27.79,11.99 27.1,11.3 26.57,11.3 v26.09,10.82 | v20.67,8.35 22.95,10.63 v23.32,10.63
RXLED
  Top 0.406: U3.17 10.96,4.73 12.01,5.78 12.01,8.41 13.3,9.7 R15.1
SCK  (via drill 0.35)
  Top 0.152: U1.26 31.96,24.05 31.16,24.05 30.83,24.38 29.18,24.38 27.99,25.57 25.84,25.57 23.84,23.57 20.16,23.57 | 20.16,23.57 v20.11,23.57 | U6.18 20.51,18.04 20.51,23.23 20.16,23.57
  Bottom 0.152: J5.4 13.92,17.38 v20.11,23.57
SCL  (via drill 0.35)
  Top 0.152: U5.2 9.19,28.56 v9.19,29.78 16.32,29.78 17.1,29 18,29 R2.1 18.64,29.59 19.39,28.84 21.29,28.84 21.91,29.47 22.57,29.47 U1.3
  Bottom 0.152: v9.19,29.78 7.65,29.78 6.27,31.16 J1.2
SDA  (via drill 0.35)
  Top 0.152: v7.55,31.4 6.6,31.4 J1.1 | U5.1 10.44,28.93 v10.95,28.93 | U1.2 22.57,30.17 21.91,30.17 21.41,29.66 R1.1 20.2,29.92 19.75,30.37 11.08,30.37 v10.92,30.53
  Bottom 0.152: v7.55,31.4 9.08,31.4 9.95,30.53 v10.92,30.53 10.92,28.96 v10.95,28.93
SWCLK  (via drill 0.35)
  Top 0.152: v28.12,10.29 28.12,7.44 27.77,7.09 DEBUG1.4 | v35.49,31.27 32.18,31.27 U1.36
  Bottom 0.152: v28.12,10.29 29.14,11.3 29.64,11.3 30.33,11.99 30.33,13.08 29.82,13.59 29.82,14.09 35.43,19.7 35.43,23.4 33.96,24.87 33.96,29.74 v35.49,31.27
SWDIO  (via drill 0.35)
  Top 0.152: v29.94,17.16 29.94,16.86 29.14,16.06 29.14,14.11 27.99,12.96 27.99,11.15 26.98,10.13 DEBUG1.2 | U1.37 32.2,31.99 v33.34,31.99
  Bottom 0.152: v29.94,17.16 29.94,22.36 30.34,22.75 30.34,27.39 29.54,28.18 29.54,29.28 32.26,31.99 v33.34,31.99
SWO  (via drill 0.35)
  Top 0.152: U1.32 32.24,28.07 32.9,28.07 33.34,27.63 33.34,27.23 v34.56,26.01 | v30.46,13.82 30.46,9.31 DEBUG1.6
  Bottom 0.152: v34.56,26.01 34.56,24.69 35.9,23.36 35.9,19.25 v30.46,13.82
TXD  (via drill 0.35)
  Top 0.152: U1.19 28.11,21.13 27.58,20.6 v27.05,20.6 | U3.20 9.62,2.77 10.65,2.77 12.44,4.56 12.44,8.18 13.28,9.02 18.26,9.02 v19.01,8.26 | v25.53,13.54 25.43,13.64 23.6,13.64 22.88,12.93 v22.88,11.52
  Bottom 0.152: v27.05,20.6 27.05,20.68 26.62,20.68 25.7,19.76 25.7,14.16 25.53,13.99 v25.53,13.54 | v22.88,11.52 22.62,11.52 19.37,8.26 v19.01,8.26
TXLED
  Top 0.152: R16.1 7.82,3.32 8.82,2.31 10.69,2.31 12.75,4.37 12.75,7.92 13.37,8.55 U3.10
USB+  (via drill 0.35)
  Top 0.152: C9.1 3.06,9.02 R10.1 3.13,10.12 v3.45,10.44
  Bottom 0.152: USB1.3 4.52,6.04 3.8,6.04 3.45,6.39 v3.45,10.44
USB-  (via drill 0.35)
  Top 0.152: R9.1 7.24,9.73 6.9,10.08 4.45,10.08 3.98,9.61 3.98,7.1 4.12,6.96 4.42,6.96 v6.26,5.13 5.68,4.56 3.79,4.56 3.41,4.17 3.41,2.26 C7.2
  Bottom 0.152: v6.26,5.13 4.79,5.13 USB1.2
V_USB  (via drill 0.35)
  Top 0.406: U3.15 8.11,6 v7.92,5.81
  Bottom 0.406: USB1.1 5.39,4.52 6.15,3.77 7,3.77 7.41,4.17 D3.+ 7.41,5.3 v7.92,5.81
VIN  (via drill 0.35)
  Top 0.61: R8.2 3.49,19.67 CHRG1.4 5.91,18.59 C6.2 6.62,18.33 7.51,17.44 7.51,16.17 4.9,13.56 4.9,11.89 5.72,11.08 9.82,11.08 v10.95,9.95 | R8.2 4.12,22.68 LDO1.3 5.62,24.57 C8.2 | LDO1.1 2.44,24.35 2.44,23.78 3.49,22.74 R8.2
  Bottom 0.61: D3.- 7.41,2.53 D2.- 9.53,2.96 12.3,5.73 12.3,8.6 v10.95,9.95
VLIPO
  Top 0.66: CHRG1.3 1.99,18.57 C12.1 1.99,16.14 J2.2
  Bottom 0.61: D2.+ 9.58,4.83 R13.2 8.57,7.04 8.57,9.4 8.32,9.65 6.75,9.65 4.86,11.53
  Bottom 0.66: 4.86,11.53 4.86,12.79 3.43,14.22 J2.2

### Text on the board
tNames: R9 | R10
_tNames: + | +